# Altium schematic sheet Debugger_Circuit.SchDoc
size A4; SheetNumber: 3; SheetTotal: 12
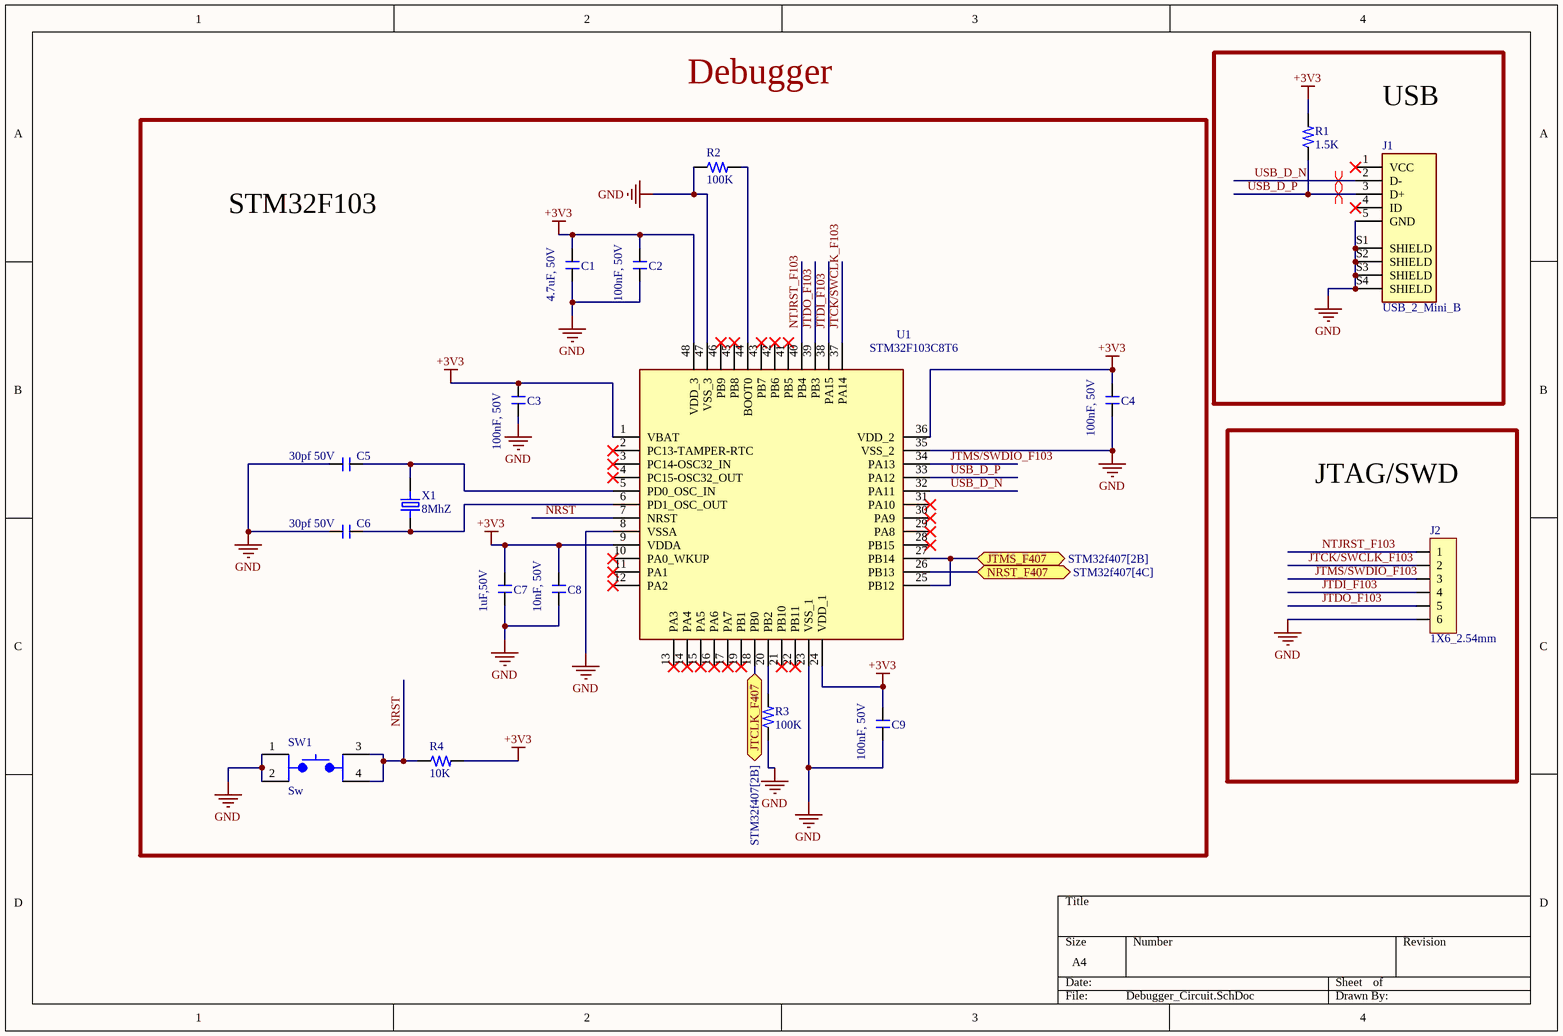
[diagram p0: Debugger_Circuit.SchDoc]

## Parts
C1  4.7uF, 50V  [Capacitor_0805]
C2  100nF, 50V  [Capacitor_0805]
C3  100nF, 50V  [Capacitor_0805]
C4  100nF, 50V  [Capacitor_0805]
C5  30pf 50V  [Capacitor_0805]
C6  30pf 50V  [Capacitor_0805]
C7  1uF,50V  [Capacitor_0805]
C8  10nF, 50V  [Capacitor_0805]
C9  100nF, 50V  [Capacitor_0805]
J1  USB_2_Mini_B  [USB_2_Mini]
J2  1X6_2.54mm  [Header_1X6_2.54mm]
R1  1.5K  [Resistor_0805]
R2  100K  [Resistor_0603]
R3  100K  [Resistor_0603]
R4  10K  [Resistor_0603]
SW1  Sw  [SW_Tactile_SMD]
U1  STM32F103C8T6  [48-LQFP]
X1  8MhZ  [XTAL_8MhZ]

## Blocks framed on the sheet
USB: J1 R1
STM32F103: C1-C9 R2-R4 SW1 U1 X1
JTAG/SWD: J2

## Ports
JTCLK_F407 (bidir, see STM32f407[2B]), JTMS_F407 (bidir, see STM32f407[2B]), NRST_F407 (bidir, see STM32f407[4C])

## Nets
+3V3: C1.1 C2.2 C3.2 C4.2 C7.2 C8.2 C9.2 R1.2 R4.2 U1.1(VBAT) U1.9(VDDA) U1.24(VDD_1) U1.36(VDD_2) U1.48(VDD_3)
GND: C1.2 C2.1 C3.1 C4.1 C5.1 C6.1 C7.1 C8.1 C9.1 J1.5(GND) J1.S1(SHIELD) J1.S2(SHIELD) J1.S3(SHIELD) J1.S4(SHIELD) J2.6 R2.1 R3.1 SW1.1 SW1.2 U1.8(VSSA) U1.23(VSS_1) U1.35(VSS_2) U1.47(VSS_3)
JTCK/SWCLK_F103: J2.2 U1.37(PA14)
JTCLK_F407: U1.18(PB0) ; port JTCLK_F407
JTDI_F103: J2.4 U1.38(PA15)
JTDO_F103: J2.5 U1.39(PB3)
JTMS/SWDIO_F103: J2.3 U1.34(PA13)
JTMS_F407: U1.25(PB12) U1.27(PB14) ; port JTMS_F407
NRST: R4.1 SW1.3 SW1.4 U1.7(NRST)
NRST_F407: U1.26(PB13) ; port NRST_F407
NTJRST_F103: J2.1 U1.40(PB4)
USB_D_N: J1.2(D-) U1.32(PA11)
USB_D_P: J1.3(D+) R1.1 U1.33(PA12)
NetC5_2: C5.2 U1.5(PD0_OSC_IN) X1.2
NetC6_2: C6.2 U1.6(PD1_OSC_OUT) X1.1
NetR2_2: R2.2 U1.44(BOOT0)
NetR3_2: R3.2 U1.20(PB2)

Not connected (* = marked no-connect by the designer): J1 1(VCC)* 4(ID)*; U1 2(PC13-TAMPER-RTC)* 3(PC14-OSC32_IN)* 4(PC15-OSC32_OUT)* 10(PA0_WKUP)* 11(PA1)* 12(PA2)* 13(PA3)* 14(PA4)* 15(PA5)* 16(PA6)* 17(PA7)* 19(PB1)* 21(PB10)* 22(PB11)* 28(PB15)* 29(PA8)* 30(PA9)* 31(PA10)* 41(PB5)* 42(PB6)* 43(PB7)* 45(PB8)* 46(PB9)*

## Layout directives
differential pair; net class diff_pair_90Ohm: USB_D_N, USB_D_P

## Notes on the sheet
- Debugger

## Library data of the parts
C1 = Cap_4.7uF_0805: Multilayer Ceramic Capacitor, 4.7 uF, 50 V, ï¿½ 10%, X5R, 0805 [2012 Metric]; Manufacturer: Murata; Manufacturer Part Number: GRM21BR61H475KE51L; Supplier: Mouser; Supplier Part Number: 81-GRM21BR61H475KE1L; RoHS: Yes; Category: Ceramic Capacitors; Stock: 172250; Pricing: 1=0,26, 10=0,141, 50=0,141, 100=0,086, 1000=0,083, 10000=0,071 (USD); Mounting Technology: Surface Mount; Case/Package: 0805; Case Code (Metric): 2012; Material: Ceramic; Case Code (Imperial): 0805; Min Operating Temperature: -55°C; Max Operating Temperature: 85°C; Packaging: Tape and Reel; Series: GRM; Value: 4.7uF; Tolerance: 10%; Dielectric: X5R; Voltage Rating: 50V; Voltage Rating (DC): 50V; Length: 2mm; Width: 0.049inch; Height: 1.25mm; Depth: 1.25mm; Thickness: 0.055inch; Reach SVHC Compliant: No; RoHS Compliant: Yes; Lead Free: 5697LeadFree; ComponentLink1URL: http://www.farnell.com/datasheets/2079186.pdf?src-supplier=Farnell; ComponentLink1Description: http://www.farnell.com/datasheets/2079186.pdf?src-supplier=Farnell; ComponentLink2URL: https://datasheet.octopart.com/GRM21BR61H475KE51L-Murata-datasheet-22122223.pdf?src-supplier=Future+Electronics; ComponentLink2Description: https://datasheet.octopart.com/GRM21BR61H475KE51L-Murata-datasheet-22122223.pdf?src-supplier=Future+Electronics; ComponentLink3URL: http://www.farnell.com/datasheets/2079186.pdf?src-supplier=Element14; ComponentLink3Description: http://www.farnell.com/datasheets/2079186.pdf?src-supplier=Element14; ComponentLink4URL: https://datasheet.octopart.com/GRM21BR61H475KE51L-Murata-datasheet-66077112.pdf?src-supplier=Element14; ComponentLink4Description: https://datasheet.octopart.com/GRM21BR61H475KE51L-Murata-datasheet-66077112.pdf?src-supplier=Element14; ComponentLink5URL: http://search.murata.co.jp/Ceramy/image/img/A01X/G101/ENG/GRM21BR61H475KE51-01.pdf?src-supplier=Digikey; ComponentLink5Description: http://search.murata.co.jp/Ceramy/image/img/A01X/G101/ENG/GRM21BR61H475KE51-01.pdf?src-supplier=Digikey; ComponentLink6URL: https://search.murata.co.jp/Ceramy/image/img/A01X/G101/ENG/GRM21BR61H475KE51-01.pdf?src-supplier=Digikey; ComponentLink6Description: https://search.murata.co.jp/Ceramy/image/img/A01X/G101/ENG/GRM21BR61H475KE51-01.pdf?src-supplier=Digikey
C2-C4 C9 = Cap_100nF_0805: Multilayer Ceramic Capacitor, 0.1 uF, 50 V, ï¿½ 10%, X7R, 0805 [2012 Metric]; Manufacturer: Samsung; Manufacturer Part Number: CL21B104KBCNNNC; Supplier: Digikey; Supplier Part Number: 1276-1003-1-ND; RoHS: Yes; Category: Ceramic Capacitors; Stock: 674609; Pricing: 1=0,08, 10=0,012, 100=0,0104, 1000=0,008 (USD); Mounting Technology: Surface Mount; Case/Package: 0805; Case Code (Metric): 2012; Case Code (Imperial): 0805; Material: Ceramic; Min Operating Temperature: -55°C; Max Operating Temperature: 125°C; Tolerance: 10%; Value: 100nF; Dielectric: X7R; Packaging: Tape and Reel; Voltage Rating: 50V; Voltage: 50V; Series: CL; Construction: Flat; Voltage Rating (DC): 50V; Length: 2mm; Width: 0.049inch; Height: 0.85mm; Depth: 1.25mm; Thickness: 0.037inch; Radiation Hardening: No; RoHS Compliant: Yes; Lead Free: 5697LeadFree; ComponentLink1URL: https://datasheet.ciiva.com/25710/cl21b104kbcnnnc-25710182.pdf?src-supplier=Digikey; ComponentLink1Description: https://datasheet.ciiva.com/25710/cl21b104kbcnnnc-25710182.pdf?src-supplier=Digikey; ComponentLink2URL: https://datasheet.ciiva.com/29199/454152-da-01-en-vs-kondensator-0805-29199814.pdf?src-supplier=Conrad; ComponentLink2Description: https://datasheet.ciiva.com/29199/454152-da-01-en-vs-kondensator-0805-29199814.pdf?src-supplier=Conrad
C5 C6 = Cap_30pf_0805: Capacitor, ceramic, 30Pf, 50Vdc, 10-% Tol, 10+% Tol, c0G-Tc Code, -30, 30Ppm-Tc Rohs Compliant: Yes; Manufacturer: KEMET; Manufacturer Part Number: C0805C300K5GACTU; Supplier: Mouser; Supplier Part Number: 80-C0805C300K5G; RoHS: Yes; Category: Ceramic Capacitors; Stock: 2572; Pricing: 1=0,27, 10=0,164, 50=0,164, 100=0,096, 1000=0,077, 10000=0,047 (USD); ComponentLink1URL: http://www.mouser.com/ds/2/212/KEM_C1003_C0G_SMD-1101588.pdf?src-supplier=Mouser; ComponentLink1Description: http://www.mouser.com/ds/2/212/KEM_C1003_C0G_SMD-1101588.pdf?src-supplier=Mouser; ComponentLink2URL: http://components.arrow.com/part/dataview/2091985S8614748N7429?src-supplier=Arrow+Electronics; ComponentLink2Description: http://components.arrow.com/part/dataview/2091985S8614748N7429?src-supplier=Arrow+Electronics; ComponentLink3URL: https://datasheet.octopart.com/C0805C300K5GACTU-KEMET-datasheet-149535491.pdf?src-supplier=Farnell; ComponentLink3Description: https://datasheet.octopart.com/C0805C300K5GACTU-KEMET-datasheet-149535491.pdf?src-supplier=Farnell; ComponentLink4URL: https://search.kemet.com/component-edge/download/datasheet/C0805C300K5GACTU.pdf?src-supplier=Digikey; ComponentLink4Description: https://search.kemet.com/component-edge/download/datasheet/C0805C300K5GACTU.pdf?src-supplier=Digikey
C7 = Cap_1uF_0805: 0805 1 uF 50 V ±5 % Tolerance X7R Surface Mount Multilayer Ceramic Capacitor; Manufacturer: Yageo; Manufacturer Part Number: CC0805JKX7R9BB105; Material: 4241ConductorMaterial; Dielectric: 1511DielectricType; Supplier: Digikey; Supplier Part Number: 311-3498-1-ND; RoHS: Yes; Category: Ceramic Capacitors; Stock: 30160; Pricing: 1=0,29, 10=0,168, 100=0,1077, 1000=0,07673 (USD); Voltage Rating (DC): 50V; Height: 1.45mm; Lead Free: 5697LeadFree; Halogen Free: 5694HalogenFree; ComponentLink1URL: https://datasheet.octopart.com/CC0805JKX7R9BB105-Yageo-datasheet-137700082.pdf?src-supplier=Future+Electronics; ComponentLink1Description: https://datasheet.octopart.com/CC0805JKX7R9BB105-Yageo-datasheet-137700082.pdf?src-supplier=Future+Electronics; ComponentLink2URL: http://www.yageo.com/documents/recent/UPY-GPHC_X7R_6.3V-to-50V_18.pdf?src-supplier=Digikey; ComponentLink2Description: http://www.yageo.com/documents/recent/UPY-GPHC_X7R_6.3V-to-50V_18.pdf?src-supplier=Digikey; ComponentLink3URL: https://datasheet.octopart.com/CC0805JKX7R9BB105-Yageo-datasheet-151948686.pdf?src-supplier=Farnell; ComponentLink3Description: https://datasheet.octopart.com/CC0805JKX7R9BB105-Yageo-datasheet-151948686.pdf?src-supplier=Farnell
C8 = Cap_10nF_0805: Multilayer Ceramic Capacitors MLCC - SMD/SMT 50V 0.01uF X7R 0805 10% AEC-Q200; Manufacturer: KEMET; Manufacturer Part Number: C0805C103K5RECAUTO; Dielectric: 1511DielectricType; Supplier: Arrow Electronics; Supplier Part Number: C0805C103K5RECAUTO; RoHS: Yes; Category: Ceramic Capacitors; Stock: 16; Pricing: 1=0,22, 10=0,0376 (USD); Voltage Rating (DC): 50V; ComponentLink1URL: http://www.farnell.com/datasheets/2723804.pdf?src-supplier=Farnell; ComponentLink1Description: http://www.farnell.com/datasheets/2723804.pdf?src-supplier=Farnell; ComponentLink2URL: https://api.kemet.com/component-edge/download/datasheet/C0805C103K5RECAUTO.pdf?src-supplier=Digikey; ComponentLink2Description: https://api.kemet.com/component-edge/download/datasheet/C0805C103K5RECAUTO.pdf?src-supplier=Digikey; ComponentLink3URL: http://www.farnell.com/datasheets/2723804.pdf?src-supplier=Newark; ComponentLink3Description: http://www.farnell.com/datasheets/2723804.pdf?src-supplier=Newark
J1 = USB2_Mini_690-B_005-299-043: Conn Mini USB 2.0 Type B RCP 5 POS 0.8mm Solder RA SMD 5 Terminal 1 Port; Manufacturer: EDAC; Manufacturer Part Number: 690-005-299-043; Number of Contacts: 5; Gender: Receptacle; Number of Ports: 1; Mating Cycles: 1500; Shielding: Unshielded; USB Standard: 6108USBStandard; Current Rating: 1A; Supplier: Digikey; Supplier Part Number: 151-1206-1-ND; RoHS: No; Category: USB Connectors; Stock: 51741; Pricing: 1=0,56, 10=0,475, 25=0,4452, 50=0,4238, 100=0,4036, 250=0,37828, 500=0,3602 (USD); Mounting Technology: Surface Mount,Horizontal; Color: Black; Contact Material: Bronze; Contact Plating: Gold; Housing Material: Thermoplastic; Insulation Color: Black; Min Operating Temperature: -30°C; Max Operating Temperature: 80°C; Packaging: Cut Tape; Series: 690; Connector Type: USB; Termination: Solder; Orientation: Right Angle; Height: 3.98mm; Pitch: 0.8mm; Lead Free: Lead Free; Flammability Rating: UL94 V-0; ComponentLink1URL: https://datasheet.ciiva.com/30246/690-005-299-043-30246515.pdf?src-supplier=Onlinecomponents.com; ComponentLink1Description: https://datasheet.ciiva.com/30246/690-005-299-043-30246515.pdf?src-supplier=Onlinecomponents.com; ComponentLink2URL: https://datasheet.ciiva.com/29660/690-005-299-043-29660027.pdf?src-supplier=Digikey; ComponentLink2Description: https://datasheet.ciiva.com/29660/690-005-299-043-29660027.pdf?src-supplier=Digikey; ComponentLink3URL: https://datasheet.ciiva.com/29660/690-005-299-043-29660028.pdf?src-supplier=Digikey; ComponentLink3Description: https://datasheet.ciiva.com/29660/690-005-299-043-29660028.pdf?src-supplier=Digikey; ComponentLink4URL: https://datasheet.ciiva.com/29660/690-005-299-043-29660029.pdf?src-supplier=Digikey; ComponentLink4Description: https://datasheet.ciiva.com/29660/690-005-299-043-29660029.pdf?src-supplier=Digikey
J2 = Header_Male_1X6_2.54mm: KK 254 Wire-to-Board Header Single Row Vertical 6 Circuits PA Polyamide Nylon Gold Plating; Manufacturer: Molex; Current Rating: 4A; Voltage Rating: 250V; Contact Resistance: 10mR; Number of Positions: 6; Gender: Male; Insulation Resistance: 50GR; Pitch: 2.54mm; Supplier: Mouser; Supplier Part Number: 538-22-10-2061; Manufacturer Part Number: 22-10-2061; RoHS: Yes; Category: Headers and Wire Housings; Stock: 2052; Pricing: 1=1,07, 10=0,873, 50=0,873, 100=0,711, 1000=0,65, 10000=0,65 (USD); Mounting Technology: Through Hole; Contact Plating: Gold,Copper,Tin; Contact Material: Brass; Color: White; Housing Color: Black; Housing Material: Nylon; Min Operating Temperature: 0°C; Max Operating Temperature: 75°C; Number of Rows: 1; Packaging: Bulk; Package Quantity: 10; Termination: Solder; Number of Contacts: 6; Orientation: Straight; Voltage Rating (DC): 250V; Number of Circuits: 6; Series: KK® 4030; Contact Type: Male Pin; Length: 95mm; Height: 14.68mm; Contact Mating Length: 0.295inch; Depth: 9.02mm; Radiation Hardening: No; Flammability Rating: UL94 V-0; RoHS Compliant: Yes; Reach SVHC Compliant: Unknown; ComponentLink1URL: https://datasheet.ciiva.com/14803/304930022102061-pcb-headers-14803678.pdf?src-supplier=Arrow+Electronics; ComponentLink1Description: https://datasheet.ciiva.com/14803/304930022102061-pcb-headers-14803678.pdf?src-supplier=Arrow+Electronics; ComponentLink2URL: https://datasheet.ciiva.com/19461/1965971-19461525.pdf?src-supplier=Jameco; ComponentLink2Description: https://datasheet.ciiva.com/19461/1965971-19461525.pdf?src-supplier=Jameco; ComponentLink3URL: https://datasheet.ciiva.com/10086/0022102061-pcb-headers-10086323.pdf?src-supplier=Avnet; ComponentLink3Description: https://datasheet.ciiva.com/10086/0022102061-pcb-headers-10086323.pdf?src-supplier=Avnet; ComponentLink4URL: https://datasheet.ciiva.com/30196/0022102061-pcb-headers-30196683.pdf?src-supplier=Onlinecomponents.com; ComponentLink4Description: https://datasheet.ciiva.com/30196/0022102061-pcb-headers-30196683.pdf?src-supplier=Onlinecomponents.com
R1 = Res_1.5K0805: Res Thick Film 0805 1.5K Ohm 1% 0.125W(1/8W) ±100ppm/C Pad SMD T/R; Manufacturer: TE Connectivity; Manufacturer Part Number: CRG0805F1K5; Voltage Rating: 150V; Value: 1.5kR; Power Rating: 125mW; Temperature Coefficient: 100ppm/°C; Number of Resistors: 1; Supplier: Digikey; Supplier Part Number: A106057CT-ND; RoHS: Yes; Category: Chip SMD Resistors; Stock: 45629; Pricing: 1=0,1, 10=0,036, 100=0,0183, 1000=0,01059, 2500=0,00888 (USD); Mounting Technology: Surface Mount; Case/Package: 0805; Case Code (Imperial): 0805; Case Code (Metric): 2012; Weight: 0.000194oz; Min Operating Temperature: -55°C; Max Operating Temperature: 125°C; Tolerance: 1%; Packaging: Tape and Reel; Resistor Type: Thick Film; Package Quantity: 5000; Termination: Solder; Number of Terminations: 2; Series: CRG; Technology: THICK FILM; Max Power Dissipation: 125mW; Operating Supply Voltage: 150V; Length: 2mm; Width: 1.25mm; Height: 0.55mm; Depth: 1.25mm; ELV: Compliant; RoHS Compliant: Yes; Military Standard: Not; ComponentLink1URL: https://datasheet.ciiva.com/11810/0900766b800a696e-11810424.pdf?src-supplier=Rs; ComponentLink1Description: https://datasheet.ciiva.com/11810/0900766b800a696e-11810424.pdf?src-supplier=Rs; ComponentLink2URL: https://datasheet.ciiva.com/30131/eng-ds-1773204-e-30131519.pdf?src-supplier=Onlinecomponents.com; ComponentLink2Description: https://datasheet.ciiva.com/30131/eng-ds-1773204-e-30131519.pdf?src-supplier=Onlinecomponents.com; ComponentLink3URL: https://datasheet.ciiva.com/16758/70063020-16758589.pdf?src-supplier=Allied+Electronics; ComponentLink3Description: https://datasheet.ciiva.com/16758/70063020-16758589.pdf?src-supplier=Allied+Electronics
R2 R3 = R_100K_0603: Res Thick Film 0603 100K Ohm 1% 0.1W(1/10W) ±100ppm/C Pad SMD Automotive T/R; Manufacturer: Stackpole Electronics; Manufacturer Part Number: RMCF0603FT100K; Value: 100kR; Max Power Dissipation: 100mW; Temperature Coefficient: 100ppm/°C; Voltage Rating: 75V; Supplier: Digikey; Supplier Part Number: RMCF0603FT100KCT-ND; RoHS: Yes; Category: Chip SMD Resistors; Stock: 722640; Pricing: 1=0,1, 10=0,02, 100=0,0091, 1000=0,0048, 2500=0,00386 (USD); Mounting Technology: Surface Mount; Case/Package: 0603; Case Code (Metric): 1608; Case Code (Imperial): 0603; Contact Plating: Tin,Matte; Min Operating Temperature: -55°C; Max Operating Temperature: 155°C; Tolerance: 1%; Packaging: Tape and Reel; Number of Terminations: 2; Features: Automotive AEC-Q200; Series: RMCF; Construction: Rectangular; Length: 1.55mm; Width: 0.031inch; Height: 0.022inch; Depth: 0.8mm; Radiation Hardening: No; Military Standard: Not; RoHS Compliant: Yes; Lead Free: 5697LeadFree; ComponentLink1URL: https://datasheet.ciiva.com/15193/getdatasheetpartid-362597-15193437.pdf?src-supplier=Verical; ComponentLink1Description: https://datasheet.ciiva.com/15193/getdatasheetpartid-362597-15193437.pdf?src-supplier=Verical
R4 = R_10K_0603: SMD Chip Resistor, 10 kOhm, ï¿½ 1%, 100 mW, 0603 [1608 Metric], Thick Film, General Purpose; Manufacturer: Yageo; Manufacturer Part Number: RC0603FR-0710KL; Voltage Rating (DC): 50V; Value: 10kR; Temperature Coefficient: 100ppm/°C; Voltage Rating: 75V; Power Rating: 100mW; Supplier: Digikey; Supplier Part Number: 311-10.0KHRCT-ND; RoHS: Yes; Category: Chip SMD Resistors; Stock: 2808060; Pricing: 1=0,1, 10=0,009, 100=0,0071, 1000=0,00612 (USD); Case/Package: 0603; Pins: 2; Case Code (Imperial): 0603; Case Code (Metric): 1608; Weight: 7.1E-05oz; Min Operating Temperature: -55°C; Max Operating Temperature: 155°C; Tolerance: 1%; Resistor Type: Thick Film; Packaging: Tape and Reel; Termination: SMD/SMT; Features: Moisture Resistant; Series: RC; Max Power Dissipation: 100mW; Number of Terminations: 2; Resistance Tolerance: 1%; Construction: Rectangular; Length: 1.6mm; Width: 0.8mm; Height: 0.45mm; Depth: 0.8mm; Lead Pitch: 0.3mm; Reach SVHC Compliant: No; Lead Free: 5697LeadFree; RoHS Compliant: Yes; Military Standard: Not; ComponentLink1URL: https://datasheet.ciiva.com/7660/38590-7660789.pdf?src-supplier=Element14; ComponentLink1Description: https://datasheet.ciiva.com/7660/38590-7660789.pdf?src-supplier=Element14; ComponentLink2URL: https://datasheet.ciiva.com/7983/443971-7983596.pdf?src-supplier=Element14; ComponentLink2Description: https://datasheet.ciiva.com/7983/443971-7983596.pdf?src-supplier=Element14; ComponentLink3URL: https://datasheet.ciiva.com/22747/443971-22747519.pdf?src-supplier=Element14; ComponentLink3Description: https://datasheet.ciiva.com/22747/443971-22747519.pdf?src-supplier=Element14; ComponentLink4URL: https://datasheet.ciiva.com/46440/1868787-46440891.pdf?src-supplier=Element14; ComponentLink4Description: https://datasheet.ciiva.com/46440/1868787-46440891.pdf?src-supplier=Element14; ComponentLink5URL: https://datasheet.ciiva.com/7746/1738695-7746239.pdf?src-supplier=Element14; ComponentLink5Description: https://datasheet.ciiva.com/7746/1738695-7746239.pdf?src-supplier=Element14; ComponentLink6URL: https://datasheet.ciiva.com/15189/getdatasheetpartid-409289-15189591.pdf?src-supplier=Verical; ComponentLink6Description: https://datasheet.ciiva.com/15189/getdatasheetpartid-409289-15189591.pdf?src-supplier=Verical
SW1 = SW_Tactile_SPST: TL3305A Series SPST 12 V 4.5 x 4.5 mm 260 gf Top Actuated SMT Tactile Switch; Manufacturer: E-Switch; Manufacturer Part Number: TL3305AF260QG; Mechanical Life: 200000Cycles; Illumination Type: Non-Illuminated; Operating Force: 260gf; Switch Travel: 0.2mm; Switch Function: Off-Mom; Actuator Type: Standard; Supplier: Digikey; Supplier Part Number: EG5353CT-ND; RoHS: No; Category: Tactile Switches; Stock: 97166; Pricing: 1=0,2, 10=0,176, 25=0,1664, 100=0,153, 250=0,14456, 500=0,1385, 1000=0,13264 (USD); Mounting Technology: Surface Mount; Min Operating Temperature: -20°C; Max Operating Temperature: 70°C; Packaging: Cut Tape; Termination: Gull Wing; Throw Configuration: SPST; Series: TL3305; Lead Free: Lead Free; ComponentLink1URL: http://www.farnell.com/datasheets/2554191.pdf?src-supplier=Farnell; ComponentLink1Description: http://www.farnell.com/datasheets/2554191.pdf?src-supplier=Farnell; ComponentLink2URL: http://www.farnell.com/datasheets/2554191.pdf?src-supplier=Newark; ComponentLink2Description: http://www.farnell.com/datasheets/2554191.pdf?src-supplier=Newark; ComponentLink3URL: http://spec_sheets.e-switch.com/specs/P010471.pdf?src-supplier=Mouser; ComponentLink3Description: http://spec_sheets.e-switch.com/specs/P010471.pdf?src-supplier=Mouser; ComponentLink4URL: http://www.farnell.com/datasheets/2554191.pdf?src-supplier=Element14; ComponentLink4Description: http://www.farnell.com/datasheets/2554191.pdf?src-supplier=Element14; ComponentLink5URL: http://spec_sheets.e-switch.com/specs/P010471.pdf?src-supplier=Digikey; ComponentLink5Description: http://spec_sheets.e-switch.com/specs/P010471.pdf?src-supplier=Digikey; ComponentLink6URL: http://spec_sheets.e-switch.com/specs/P010471.pdf?src-supplier=NAC+Semi; ComponentLink6Description: http://spec_sheets.e-switch.com/specs/P010471.pdf?src-supplier=NAC+Semi
U1 = MCU_STM32F103C8T6: ARM Cortex-M3 STM32 F1 Microcontroller 32-Bit 72MHz 64kB FLASH LQFP48 STM32F103C8T6; Manufacturer: STMicroelectronics; RAM Size: 20KB; Interface: I2C,SPI,USB,CAN,USART; Number of I/Os: 37; Number of Timers/Counters: 3; Max Supply Voltage: 3.6V; Number of ADC Channels: 10; Min Supply Voltage: 2V; Data Bus Width: 32b; Nominal Supply Current: 1.7uA; Number of A/D Converters: 2NUMBER; Number of Channels: 10NUMBER; Supplier: Arrow Electronics; Supplier Part Number: STM32F103C8T6; Manufacturer Part Number: STM32F103C8T6; RoHS: Yes; Category: Microcontrollers; Stock: 1121974; Pricing: 1=2,2959, 10=2,163, 25=2,0371, 50=2,029, 100=2,0223, 250=1,8714 (USD); Case/Package: LQFP; Pins: 48; Weight: 0.006349oz; Min Operating Temperature: -40°C; Max Operating Temperature: 85°C; Packaging: Tray; Package Quantity: 1500; Memory Format: FLASH; Clock Frequency: 72MHz; Memory Size: 64KB; Core Architecture: ARM; Series: STM32F103C8; Length: 7mm; Width: 7mm; Height: 1.4mm; Lead Free: 5697LeadFree; RoHS Compliant: Yes; ComponentLink1URL: https://datasheet.ciiva.com/15122/getdatasheetpartid-69880-15122076.pdf?src-supplier=Verical; ComponentLink1Description: https://datasheet.ciiva.com/15122/getdatasheetpartid-69880-15122076.pdf?src-supplier=Verical; ComponentLink2URL: https://datasheet.ciiva.com/14100/pustm-arm-microcont-stm32f103-en-14100508.pdf?src-supplier=Distrelec; ComponentLink2Description: https://datasheet.ciiva.com/14100/pustm-arm-microcont-stm32f103-en-14100508.pdf?src-supplier=Distrelec; ComponentLink3URL: https://datasheet.ciiva.com/16210/cd00161566-16210248.pdf?src-supplier=Future+Electronics; ComponentLink3Description: https://datasheet.ciiva.com/16210/cd00161566-16210248.pdf?src-supplier=Future+Electronics; ComponentLink4URL: https://datasheet.ciiva.com/8054/1730126-8054942.pdf?src-supplier=Element14; ComponentLink4Description: https://datasheet.ciiva.com/8054/1730126-8054942.pdf?src-supplier=Element14; ComponentLink5URL: https://datasheet.ciiva.com/48687/001075658-da-01-en-mcu-64kb-mem-stm32f103c8t6-lqfp-48-stm-48687589.pdf?src-supplier=Conrad; ComponentLink5Description: https://datasheet.ciiva.com/48687/001075658-da-01-en-mcu-64kb-mem-stm32f103c8t6-lqfp-48-stm-48687589.pdf?src-supplier=Conrad
X1 = Xtal_8MHz: Crystal 8MHz ±30ppm (Tol) ±50ppm (Stability) 32pF FUND 60Ohm 2-Pin HC-49/USX SMD T/R; Manufacturer: ECS International; Manufacturer Part Number: ECS-80-32-5PX-TR; Supplier: Digikey; Supplier Part Number: XC1272CT-ND; RoHS: Yes; Category: Crystals; Stock: 6065; Pricing: 1=0,3, 10=0,259, 50=0,235, 100=0,2252, 500=0,20416 (USD); ComponentLink1URL: https://datasheet.ciiva.com/852/csm-7x-852413.pdf?src-supplier=Digikey; ComponentLink1Description: https://datasheet.ciiva.com/852/csm-7x-852413.pdf?src-supplier=Digikey; ComponentLink2URL: https://datasheet.ciiva.com/852/csm-7x-852414.pdf?src-supplier=Digikey; ComponentLink2Description: https://datasheet.ciiva.com/852/csm-7x-852414.pdf?src-supplier=Digikey; ComponentLink3URL: https://datasheet.ciiva.com/852/csm-7x-852415.pdf?src-supplier=Digikey; ComponentLink3Description: https://datasheet.ciiva.com/852/csm-7x-852415.pdf?src-supplier=Digikey